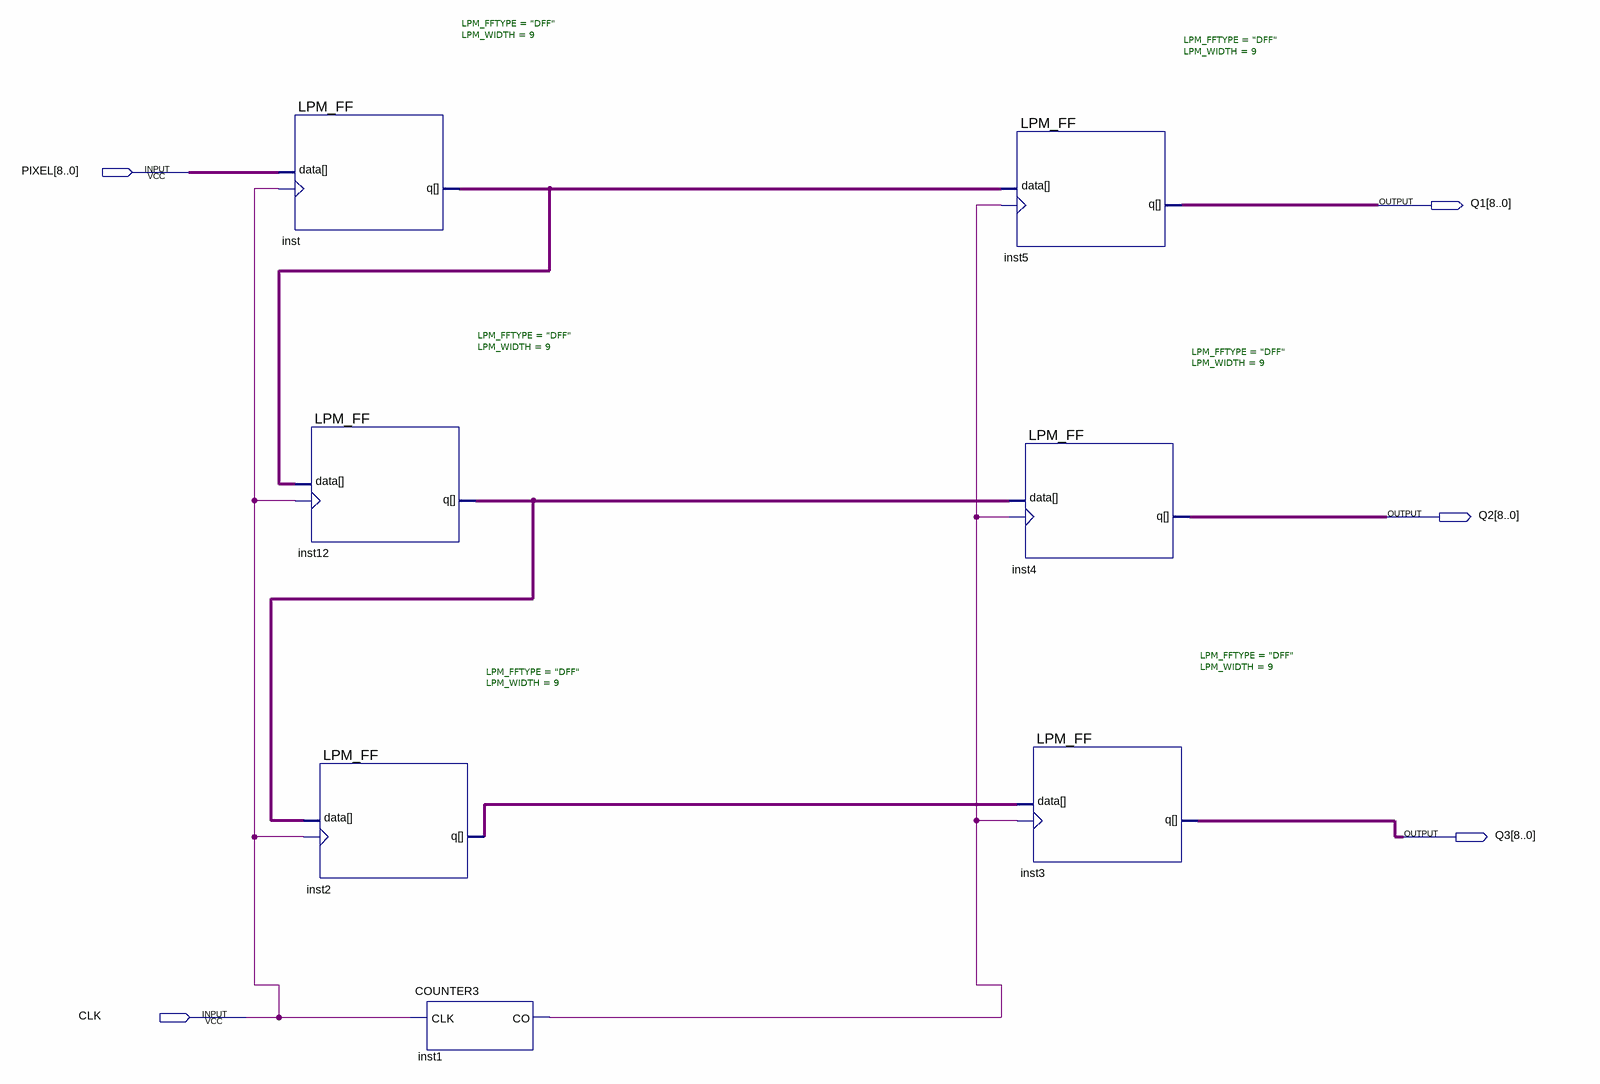
[diagram p0: schematic sheet]
// Quartus schematic SIPO3.bdf as structural Verilog: 7 symbols, 5 pins
module SIPO3 (
  input  [8:0] PIXEL,
  input  CLK,
  output [8:0] Q1,
  output [8:0] Q2,
  output [8:0] Q3
);

  wire inst1_co;
  wire [8:0] inst2_q, inst12_q, inst_q;

  LPM_FF #(.LPM_FFTYPE("DFF"), .LPM_WIDTH(9)) inst (.clock(CLK), .data(PIXEL), .q(inst_q));
  LPM_FF #(.LPM_FFTYPE("DFF"), .LPM_WIDTH(9)) inst12 (.clock(CLK), .data(inst_q), .q(inst12_q));
  LPM_FF #(.LPM_FFTYPE("DFF"), .LPM_WIDTH(9)) inst2 (.clock(CLK), .data(inst12_q), .q(inst2_q));
  COUNTER3 inst1 (.CLK(CLK), .CO(inst1_co));
  LPM_FF #(.LPM_FFTYPE("DFF"), .LPM_WIDTH(9)) inst5 (.clock(inst1_co), .data(inst_q), .q(Q1));
  LPM_FF #(.LPM_FFTYPE("DFF"), .LPM_WIDTH(9)) inst4 (.clock(inst1_co), .data(inst12_q), .q(Q2));
  LPM_FF #(.LPM_FFTYPE("DFF"), .LPM_WIDTH(9)) inst3 (.clock(inst1_co), .data(inst2_q), .q(Q3));
endmodule
